# Altium schematic sheet 88路激光器工程_2.SchDoc: Laser Driver Board 02
size A2; Revision: V01; SheetNumber: 2; SheetTotal: 3; DocStatus: Draft
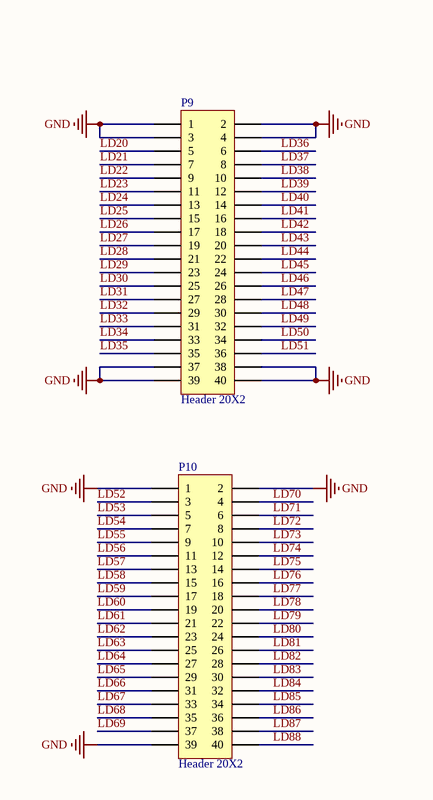
[diagram p0: 88路激光器工程_2.SchDoc, top left]
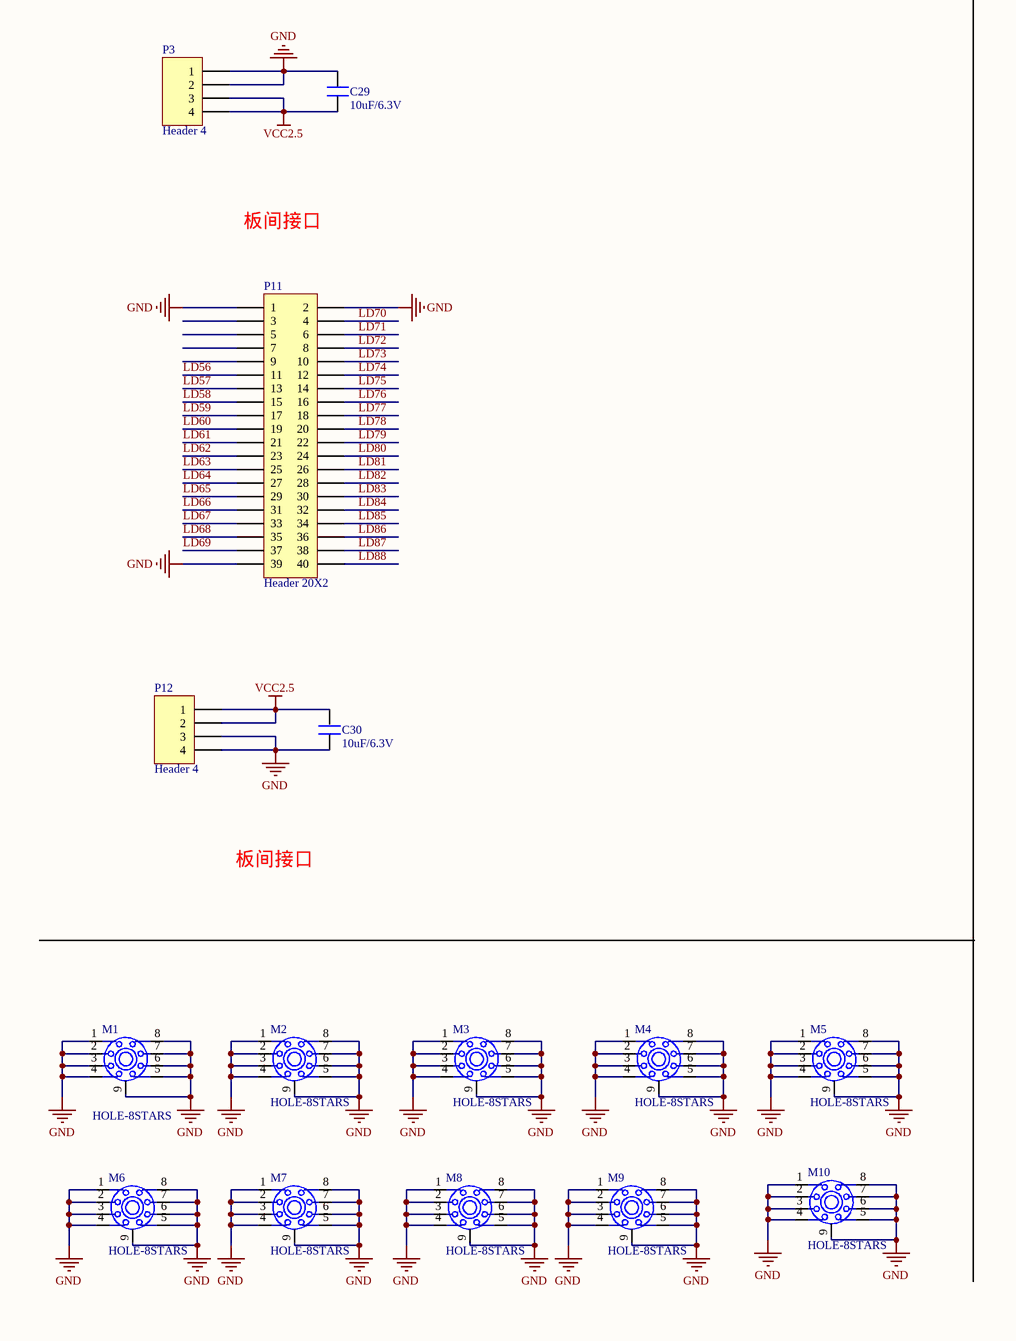
[diagram p1: 88路激光器工程_2.SchDoc, bottom left]
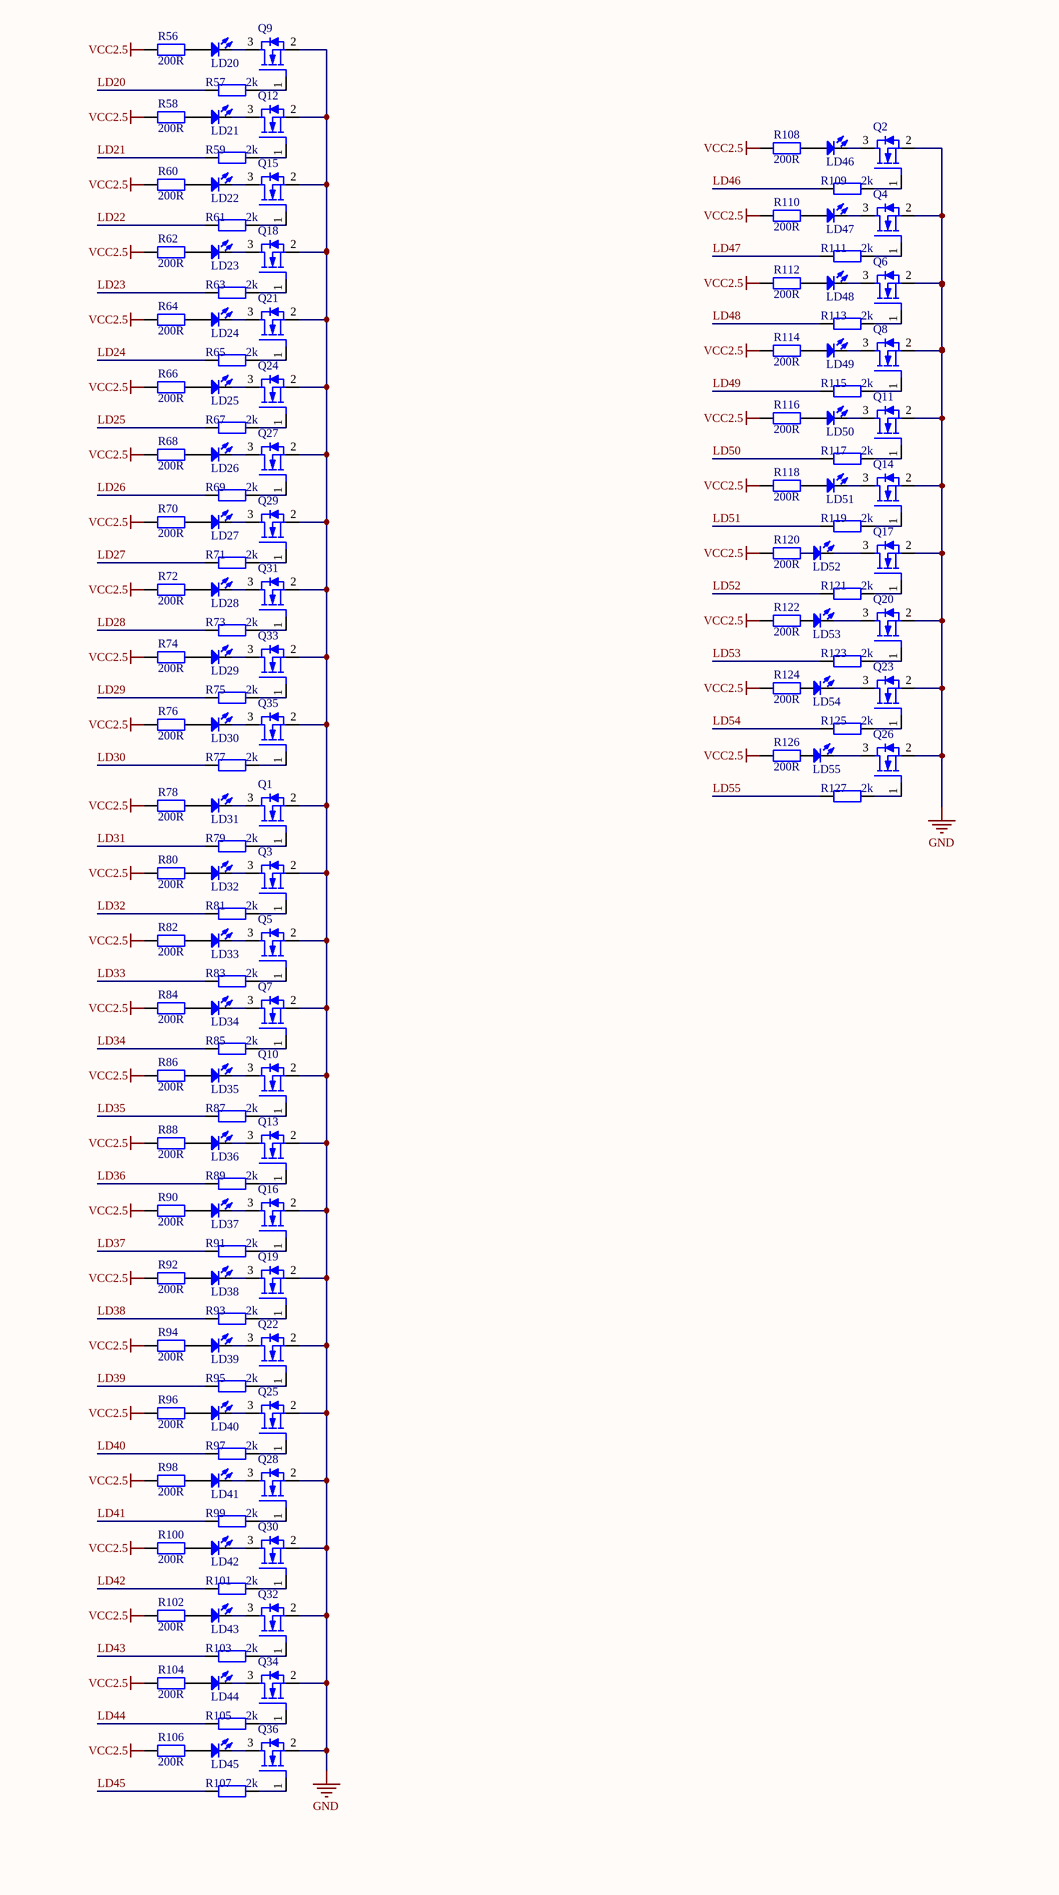
[diagram p2: 88路激光器工程_2.SchDoc, bottom right]

## Parts
C29  10uF/6.3V  [C0805]
C30  10uF/6.3V  [C0805]
LD20  LD  [LD_3P]  (value not drawn)
LD21  LD  [LD_3P]  (value not drawn)
LD22  LD  [LD_3P]  (value not drawn)
LD23  LD  [LD_3P]  (value not drawn)
LD24  LD  [LD_3P]  (value not drawn)
LD25  LD  [LD_3P]  (value not drawn)
LD26  LD  [LD_3P]  (value not drawn)
LD27  LD  [LD_3P]  (value not drawn)
LD28  LD  [LD_3P]  (value not drawn)
LD29  LD  [LD_3P]  (value not drawn)
LD30  LD  [LD_3P]  (value not drawn)
LD31  LD  [LD_3P]  (value not drawn)
LD32  LD  [LD_3P]  (value not drawn)
LD33  LD  [LD_3P]  (value not drawn)
LD34  LD  [LD_3P]  (value not drawn)
LD35  LD  [LD_3P]  (value not drawn)
LD36  LD  [LD_3P]  (value not drawn)
LD37  LD  [LD_3P]  (value not drawn)
LD38  LD  [LD_3P]  (value not drawn)
LD39  LD  [LD_3P]  (value not drawn)
LD40  LD  [LD_3P]  (value not drawn)
LD41  LD  [LD_3P]  (value not drawn)
LD42  LD  [LD_3P]  (value not drawn)
LD43  LD  [LD_3P]  (value not drawn)
LD44  LD  [LD_3P]  (value not drawn)
LD45  LD  [LD_3P]  (value not drawn)
LD46  LD  [LD_3P]  (value not drawn)
LD47  LD  [LD_3P]  (value not drawn)
LD48  LD  [LD_3P]  (value not drawn)
LD49  LD  [LD_3P]  (value not drawn)
LD50  LD  [LD_3P]  (value not drawn)
LD51  LD  [LD_3P]  (value not drawn)
LD52  LD  [LD_3P]  (value not drawn)
LD53  LD  [LD_3P]  (value not drawn)
LD54  LD  [LD_3P]  (value not drawn)
LD55  LD  [LD_3P]  (value not drawn)
M1  HOLE-8STARS  [HOLE_3MM]
M2  HOLE-8STARS  [HOLE_3MM]
M3  HOLE-8STARS  [HOLE_3MM]
M4  HOLE-8STARS  [HOLE_3MM]
M5  HOLE-8STARS  [HOLE_3MM]
M6  HOLE-8STARS  [HOLE_3MM]
M7  HOLE-8STARS  [HOLE_3MM]
M8  HOLE-8STARS  [HOLE_3MM]
M9  HOLE-8STARS  [HOLE_3MM]
M10  HOLE-8STARS  [HOLE_3MM]
P3  Header 4  [XH2.54MM_4P_立式]
P9  Header 20X2  [JATG_2.0mm_2x20P_SMD]
P10  Header 20X2  [JATG_2.0mm_2x20P_SMD]
P11  Header 20X2  [JATG_2.0mm_2x20P_SMD]
P12  Header 4  [XH2.54MM_4P_立式]
Q1  NMOS  [SOT23-3]  (value not drawn)
Q2  NMOS  [SOT23-3]  (value not drawn)
Q3  NMOS  [SOT23-3]  (value not drawn)
Q4  NMOS  [SOT23-3]  (value not drawn)
Q5  NMOS  [SOT23-3]  (value not drawn)
Q6  NMOS  [SOT23-3]  (value not drawn)
Q7  NMOS  [SOT23-3]  (value not drawn)
Q8  NMOS  [SOT23-3]  (value not drawn)
Q9  NMOS  [SOT23-3]  (value not drawn)
Q10  NMOS  [SOT23-3]  (value not drawn)
Q11  NMOS  [SOT23-3]  (value not drawn)
Q12  NMOS  [SOT23-3]  (value not drawn)
Q13  NMOS  [SOT23-3]  (value not drawn)
Q14  NMOS  [SOT23-3]  (value not drawn)
Q15  NMOS  [SOT23-3]  (value not drawn)
Q16  NMOS  [SOT23-3]  (value not drawn)
Q17  NMOS  [SOT23-3]  (value not drawn)
Q18  NMOS  [SOT23-3]  (value not drawn)
Q19  NMOS  [SOT23-3]  (value not drawn)
Q20  NMOS  [SOT23-3]  (value not drawn)
Q21  NMOS  [SOT23-3]  (value not drawn)
Q22  NMOS  [SOT23-3]  (value not drawn)
Q23  NMOS  [SOT23-3]  (value not drawn)
Q24  NMOS  [SOT23-3]  (value not drawn)
Q25  NMOS  [SOT23-3]  (value not drawn)
Q26  NMOS  [SOT23-3]  (value not drawn)
Q27  NMOS  [SOT23-3]  (value not drawn)
Q28  NMOS  [SOT23-3]  (value not drawn)
Q29  NMOS  [SOT23-3]  (value not drawn)
Q30  NMOS  [SOT23-3]  (value not drawn)
Q31  NMOS  [SOT23-3]  (value not drawn)
Q32  NMOS  [SOT23-3]  (value not drawn)
Q33  NMOS  [SOT23-3]  (value not drawn)
Q34  NMOS  [SOT23-3]  (value not drawn)
Q35  NMOS  [SOT23-3]  (value not drawn)
Q36  NMOS  [SOT23-3]  (value not drawn)
R56  200R  [R0805]
R57  2k  [R0805]
R58  200R  [R0805]
R59  2k  [R0805]
R60  200R  [R0805]
R61  2k  [R0805]
R62  200R  [R0805]
R63  2k  [R0805]
R64  200R  [R0805]
R65  2k  [R0805]
R66  200R  [R0805]
R67  2k  [R0805]
R68  200R  [R0805]
R69  2k  [R0805]
R70  200R  [R0805]
R71  2k  [R0805]
R72  200R  [R0805]
R73  2k  [R0805]
R74  200R  [R0805]
R75  2k  [R0805]
R76  200R  [R0805]
R77  2k  [R0805]
R78  200R  [R0805]
R79  2k  [R0805]
R80  200R  [R0805]
R81  2k  [R0805]
R82  200R  [R0805]
R83  2k  [R0805]
R84  200R  [R0805]
R85  2k  [R0805]
R86  200R  [R0805]
R87  2k  [R0805]
R88  200R  [R0805]
R89  2k  [R0805]
R90  200R  [R0805]
R91  2k  [R0805]
R92  200R  [R0805]
R93  2k  [R0805]
R94  200R  [R0805]
R95  2k  [R0805]
R96  200R  [R0805]
R97  2k  [R0805]
R98  200R  [R0805]
R99  2k  [R0805]
R100  200R  [R0805]
R101  2k  [R0805]
R102  200R  [R0805]
R103  2k  [R0805]
R104  200R  [R0805]
R105  2k  [R0805]
R106  200R  [R0805]
R107  2k  [R0805]
R108  200R  [R0805]
R109  2k  [R0805]
R110  200R  [R0805]
R111  2k  [R0805]
R112  200R  [R0805]
R113  2k  [R0805]
R114  200R  [R0805]
R115  2k  [R0805]
R116  200R  [R0805]
R117  2k  [R0805]
R118  200R  [R0805]
R119  2k  [R0805]
R120  200R  [R0805]
R121  2k  [R0805]
R122  200R  [R0805]
R123  2k  [R0805]
R124  200R  [R0805]
R125  2k  [R0805]
R126  200R  [R0805]
R127  2k  [R0805]

## Nets
GND: C29.2 C30.1 M1.1 M1.2 M1.3 M1.4 M1.5 M1.6 M1.7 M1.8 M1.9 M2.1 M2.2 M2.3 M2.4 M2.5 M2.6 M2.7 M2.8 M2.9 M3.1 M3.2 M3.3 M3.4 M3.5 M3.6 M3.7 M3.8 M3.9 M4.1 M4.2 M4.3 M4.4 M4.5 M4.6 M4.7 M4.8 M4.9 M5.1 M5.2 M5.3 M5.4 M5.5 M5.6 M5.7 M5.8 M5.9 M6.1 M6.2 M6.3 M6.4 M6.5 M6.6 M6.7 M6.8 M6.9 M7.1 M7.2 M7.3 M7.4 M7.5 M7.6 M7.7 M7.8 M7.9 M8.1 M8.2 M8.3 M8.4 M8.5 M8.6 M8.7 M8.8 M8.9 M9.1 M9.2 M9.3 M9.4 M9.5 M9.6 M9.7 M9.8 M9.9 M10.1 M10.2 M10.3 M10.4 M10.5 M10.6 M10.7 M10.8 M10.9 P3.1 P3.2 P9.1 P9.2 P9.3 P9.4 P9.37 P9.38 P9.39 P9.40 P10.1 P10.2 P10.39 P11.1 P11.2 P11.39 P12.3 P12.4 Q1.2(SOURCE) Q2.2(SOURCE) Q3.2(SOURCE) Q4.2(SOURCE) Q5.2(SOURCE) Q6.2(SOURCE) Q7.2(SOURCE) Q8.2(SOURCE) Q9.2(SOURCE) Q10.2(SOURCE) Q11.2(SOURCE) Q12.2(SOURCE) Q13.2(SOURCE) Q14.2(SOURCE) Q15.2(SOURCE) Q16.2(SOURCE) Q17.2(SOURCE) Q18.2(SOURCE) Q19.2(SOURCE) Q20.2(SOURCE) Q21.2(SOURCE) Q22.2(SOURCE) Q23.2(SOURCE) Q24.2(SOURCE) Q25.2(SOURCE) Q26.2(SOURCE) Q27.2(SOURCE) Q28.2(SOURCE) Q29.2(SOURCE) Q30.2(SOURCE) Q31.2(SOURCE) Q32.2(SOURCE) Q33.2(SOURCE) Q34.2(SOURCE) Q35.2(SOURCE) Q36.2(SOURCE)
VCC2.5: C29.1 C30.2 P3.3 P3.4 P12.1 P12.2 R56.2 R58.2 R60.2 R62.2 R64.2 R66.2 R68.2 R70.2 R72.2 R74.2 R76.2 R78.2 R80.2 R82.2 R84.2 R86.2 R88.2 R90.2 R92.2 R94.2 R96.2 R98.2 R100.2 R102.2 R104.2 R106.2 R108.2 R110.2 R112.2 R114.2 R116.2 R118.2 R120.2 R122.2 R124.2 R126.2
LD20: P9.5 R57.2
LD21: P9.7 R59.2
LD22: P9.9 R61.2
LD23: P9.11 R63.2
LD24: P9.13 R65.2
LD25: P9.15 R67.2
LD26: P9.17 R69.2
LD27: P9.19 R71.2
LD28: P9.21 R73.2
LD29: P9.23 R75.2
LD30: P9.25 R77.2
LD31: P9.27 R79.2
LD32: P9.29 R81.2
LD33: P9.31 R83.2
LD34: P9.33 R85.2
LD35: P9.35 R87.2
LD36: P9.6 R89.2
LD37: P9.8 R91.2
LD38: P9.10 R93.2
LD39: P9.12 R95.2
LD40: P9.14 R97.2
LD41: P9.16 R99.2
LD42: P9.18 R101.2
LD43: P9.20 R103.2
LD44: P9.22 R105.2
LD45: P9.24 R107.2
LD46: P9.26 R109.2
LD47: P9.28 R111.2
LD48: P9.30 R113.2
LD49: P9.32 R115.2
LD50: P9.34 R117.2
LD51: P9.36 R119.2
LD52: P10.3 R121.2
LD53: P10.5 R123.2
LD54: P10.7 R125.2
LD55: P10.9 R127.2
LD56: P10.11 P11.11
LD57: P10.13 P11.13
LD58: P10.15 P11.15
LD59: P10.17 P11.17
LD60: P10.19 P11.19
LD61: P10.21 P11.21
LD62: P10.23 P11.23
LD63: P10.25 P11.25
LD64: P10.27 P11.27
LD65: P10.29 P11.29
LD66: P10.31 P11.31
LD67: P10.33 P11.33
LD68: P10.35 P11.35
LD69: P10.37 P11.37
LD70: P10.4 P11.4
LD71: P10.6 P11.6
LD72: P10.8 P11.8
LD73: P10.10 P11.10
LD74: P10.12 P11.12
LD75: P10.14 P11.14
LD76: P10.16 P11.16
LD77: P10.18 P11.18
LD78: P10.20 P11.20
LD79: P10.22 P11.22
LD80: P10.24 P11.24
LD81: P10.26 P11.26
LD82: P10.28 P11.28
LD83: P10.30 P11.30
LD84: P10.32 P11.32
LD85: P10.34 P11.34
LD86: P10.36 P11.36
LD87: P10.38 P11.38
LD88: P10.40 P11.40
NetLD20_1: LD20.1(A) R56.1
NetLD20_2: LD20.2(K) Q9.3(DRAIN)
NetLD21_1: LD21.1(A) R58.1
NetLD21_2: LD21.2(K) Q12.3(DRAIN)
NetLD22_1: LD22.1(A) R60.1
NetLD22_2: LD22.2(K) Q15.3(DRAIN)
NetLD23_1: LD23.1(A) R62.1
NetLD23_2: LD23.2(K) Q18.3(DRAIN)
NetLD24_1: LD24.1(A) R64.1
NetLD24_2: LD24.2(K) Q21.3(DRAIN)
NetLD25_1: LD25.1(A) R66.1
NetLD25_2: LD25.2(K) Q24.3(DRAIN)
NetLD26_1: LD26.1(A) R68.1
NetLD26_2: LD26.2(K) Q27.3(DRAIN)
NetLD27_1: LD27.1(A) R70.1
NetLD27_2: LD27.2(K) Q29.3(DRAIN)
NetLD28_1: LD28.1(A) R72.1
NetLD28_2: LD28.2(K) Q31.3(DRAIN)
NetLD29_1: LD29.1(A) R74.1
NetLD29_2: LD29.2(K) Q33.3(DRAIN)
NetLD30_1: LD30.1(A) R76.1
NetLD30_2: LD30.2(K) Q35.3(DRAIN)
NetLD31_1: LD31.1(A) R78.1
NetLD31_2: LD31.2(K) Q1.3(DRAIN)
NetLD32_1: LD32.1(A) R80.1
NetLD32_2: LD32.2(K) Q3.3(DRAIN)
NetLD33_1: LD33.1(A) R82.1
NetLD33_2: LD33.2(K) Q5.3(DRAIN)
NetLD34_1: LD34.1(A) R84.1
NetLD34_2: LD34.2(K) Q7.3(DRAIN)
NetLD35_1: LD35.1(A) R86.1
NetLD35_2: LD35.2(K) Q10.3(DRAIN)
NetLD36_1: LD36.1(A) R88.1
NetLD36_2: LD36.2(K) Q13.3(DRAIN)
NetLD37_1: LD37.1(A) R90.1
NetLD37_2: LD37.2(K) Q16.3(DRAIN)
NetLD38_1: LD38.1(A) R92.1
NetLD38_2: LD38.2(K) Q19.3(DRAIN)
NetLD39_1: LD39.1(A) R94.1
NetLD39_2: LD39.2(K) Q22.3(DRAIN)
NetLD40_1: LD40.1(A) R96.1
NetLD40_2: LD40.2(K) Q25.3(DRAIN)
NetLD41_1: LD41.1(A) R98.1
NetLD41_2: LD41.2(K) Q28.3(DRAIN)
NetLD42_1: LD42.1(A) R100.1
NetLD42_2: LD42.2(K) Q30.3(DRAIN)
NetLD43_1: LD43.1(A) R102.1
NetLD43_2: LD43.2(K) Q32.3(DRAIN)
NetLD44_1: LD44.1(A) R104.1
NetLD44_2: LD44.2(K) Q34.3(DRAIN)
NetLD45_1: LD45.1(A) R106.1
NetLD45_2: LD45.2(K) Q36.3(DRAIN)
NetLD46_1: LD46.1(A) R108.1
NetLD46_2: LD46.2(K) Q2.3(DRAIN)
NetLD47_1: LD47.1(A) R110.1
NetLD47_2: LD47.2(K) Q4.3(DRAIN)
NetLD48_1: LD48.1(A) R112.1
NetLD48_2: LD48.2(K) Q6.3(DRAIN)
NetLD49_1: LD49.1(A) R114.1
NetLD49_2: LD49.2(K) Q8.3(DRAIN)
NetLD50_1: LD50.1(A) R116.1
NetLD50_2: LD50.2(K) Q11.3(DRAIN)
NetLD51_1: LD51.1(A) R118.1
NetLD51_2: LD51.2(K) Q14.3(DRAIN)
NetLD52_1: LD52.1(A) R120.1
NetLD52_2: LD52.2(K) Q17.3(DRAIN)
NetLD53_1: LD53.1(A) R122.1
NetLD53_2: LD53.2(K) Q20.3(DRAIN)
NetLD54_1: LD54.1(A) R124.1
NetLD54_2: LD54.2(K) Q23.3(DRAIN)
NetLD55_1: LD55.1(A) R126.1
NetLD55_2: LD55.2(K) Q26.3(DRAIN)
NetQ1_1: Q1.1(GATE) R79.1
NetQ2_1: Q2.1(GATE) R109.1
NetQ3_1: Q3.1(GATE) R81.1
NetQ4_1: Q4.1(GATE) R111.1
NetQ5_1: Q5.1(GATE) R83.1
NetQ6_1: Q6.1(GATE) R113.1
NetQ7_1: Q7.1(GATE) R85.1
NetQ8_1: Q8.1(GATE) R115.1
NetQ9_1: Q9.1(GATE) R57.1
NetQ10_1: Q10.1(GATE) R87.1
NetQ11_1: Q11.1(GATE) R117.1
NetQ12_1: Q12.1(GATE) R59.1
NetQ13_1: Q13.1(GATE) R89.1
NetQ14_1: Q14.1(GATE) R119.1
NetQ15_1: Q15.1(GATE) R61.1
NetQ16_1: Q16.1(GATE) R91.1
NetQ17_1: Q17.1(GATE) R121.1
NetQ18_1: Q18.1(GATE) R63.1
NetQ19_1: Q19.1(GATE) R93.1
NetQ20_1: Q20.1(GATE) R123.1
NetQ21_1: Q21.1(GATE) R65.1
NetQ22_1: Q22.1(GATE) R95.1
NetQ23_1: Q23.1(GATE) R125.1
NetQ24_1: Q24.1(GATE) R67.1
NetQ25_1: Q25.1(GATE) R97.1
NetQ26_1: Q26.1(GATE) R127.1
NetQ27_1: Q27.1(GATE) R69.1
NetQ28_1: Q28.1(GATE) R99.1
NetQ29_1: Q29.1(GATE) R71.1
NetQ30_1: Q30.1(GATE) R101.1
NetQ31_1: Q31.1(GATE) R73.1
NetQ32_1: Q32.1(GATE) R103.1
NetQ33_1: Q33.1(GATE) R75.1
NetQ34_1: Q34.1(GATE) R105.1
NetQ35_1: Q35.1(GATE) R77.1
NetQ36_1: Q36.1(GATE) R107.1

Not connected (* = marked no-connect by the designer): P11 3 5 7 9

## Notes on the sheet
- 板间接口
- Title
- Status
- Rev
- Date
- Sheet
- of

## Library data of the parts
C29 C30 = C
P3 P12 = Header 4: Header, 4-Pin; LatestRevisionDate: 17-Jul-2002; LatestRevisionNote: Re-released for DXP Platform.; Publisher: Altium Limited
P9-P11 = Header 20X2: Header, 20-Pin, Dual row; LatestRevisionDate: 17-Jul-2002; LatestRevisionNote: Re-released for DXP Platform.; Publisher: Altium Limited
R56-R127 = Res2: Resistor; Published: 8-Jun-2000; LatestRevisionDate: 17-Jul-2002; LatestRevisionNote: Re-released for DXP Platform.; PackageReference: AXIAL-0.4; Publisher: Altium Limited; PackageDescription: Axial Device, Thru-Hole; 2 Leads; 0.4 in Pin Spacing
  R56 R58 R60 R62 R64 R66 R68 R70 R72 R74 R76 R78 R80 R82 R84 R86 R88 R90 R92 R94 R96 R98 R100 R102 R104 R106 R108 R110 R112 R114 R116 R118 R120 R122 R124 R126: Value: 200R
  R57 R59 R61 R63 R65 R67 R69 R71 R73 R75 R77 R79 R81 R83 R85 R87 R89 R91 R93 R95 R97 R99 R101 R103 R105 R107 R109 R111 R113 R115 R117 R119 R121 R123 R125 R127: Value: 2k